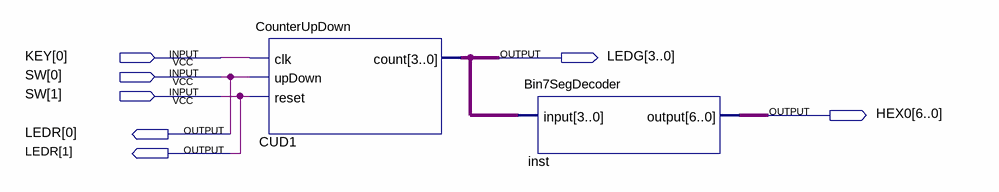
[diagram p0: schematic sheet]
// Quartus schematic Counter_Demo.bdf as structural Verilog: 2 symbols, 7 pins
module Counter_Demo (
  input  [0:0] KEY,
  input  [1:0] SW,
  output [3:0] LEDG,
  output [6:0] HEX0,
  output [1:0] LEDR
);

  CounterUpDown CUD1 (.clk(KEY[0]), .upDown(SW[0]), .reset(SW[1]), .count(LEDG));
  Bin7SegDecoder inst (.\input (LEDG), .\output (HEX0));

  assign LEDR = SW;
endmodule
